# Altium schematic sheet [02] Power.SchDoc
size A3
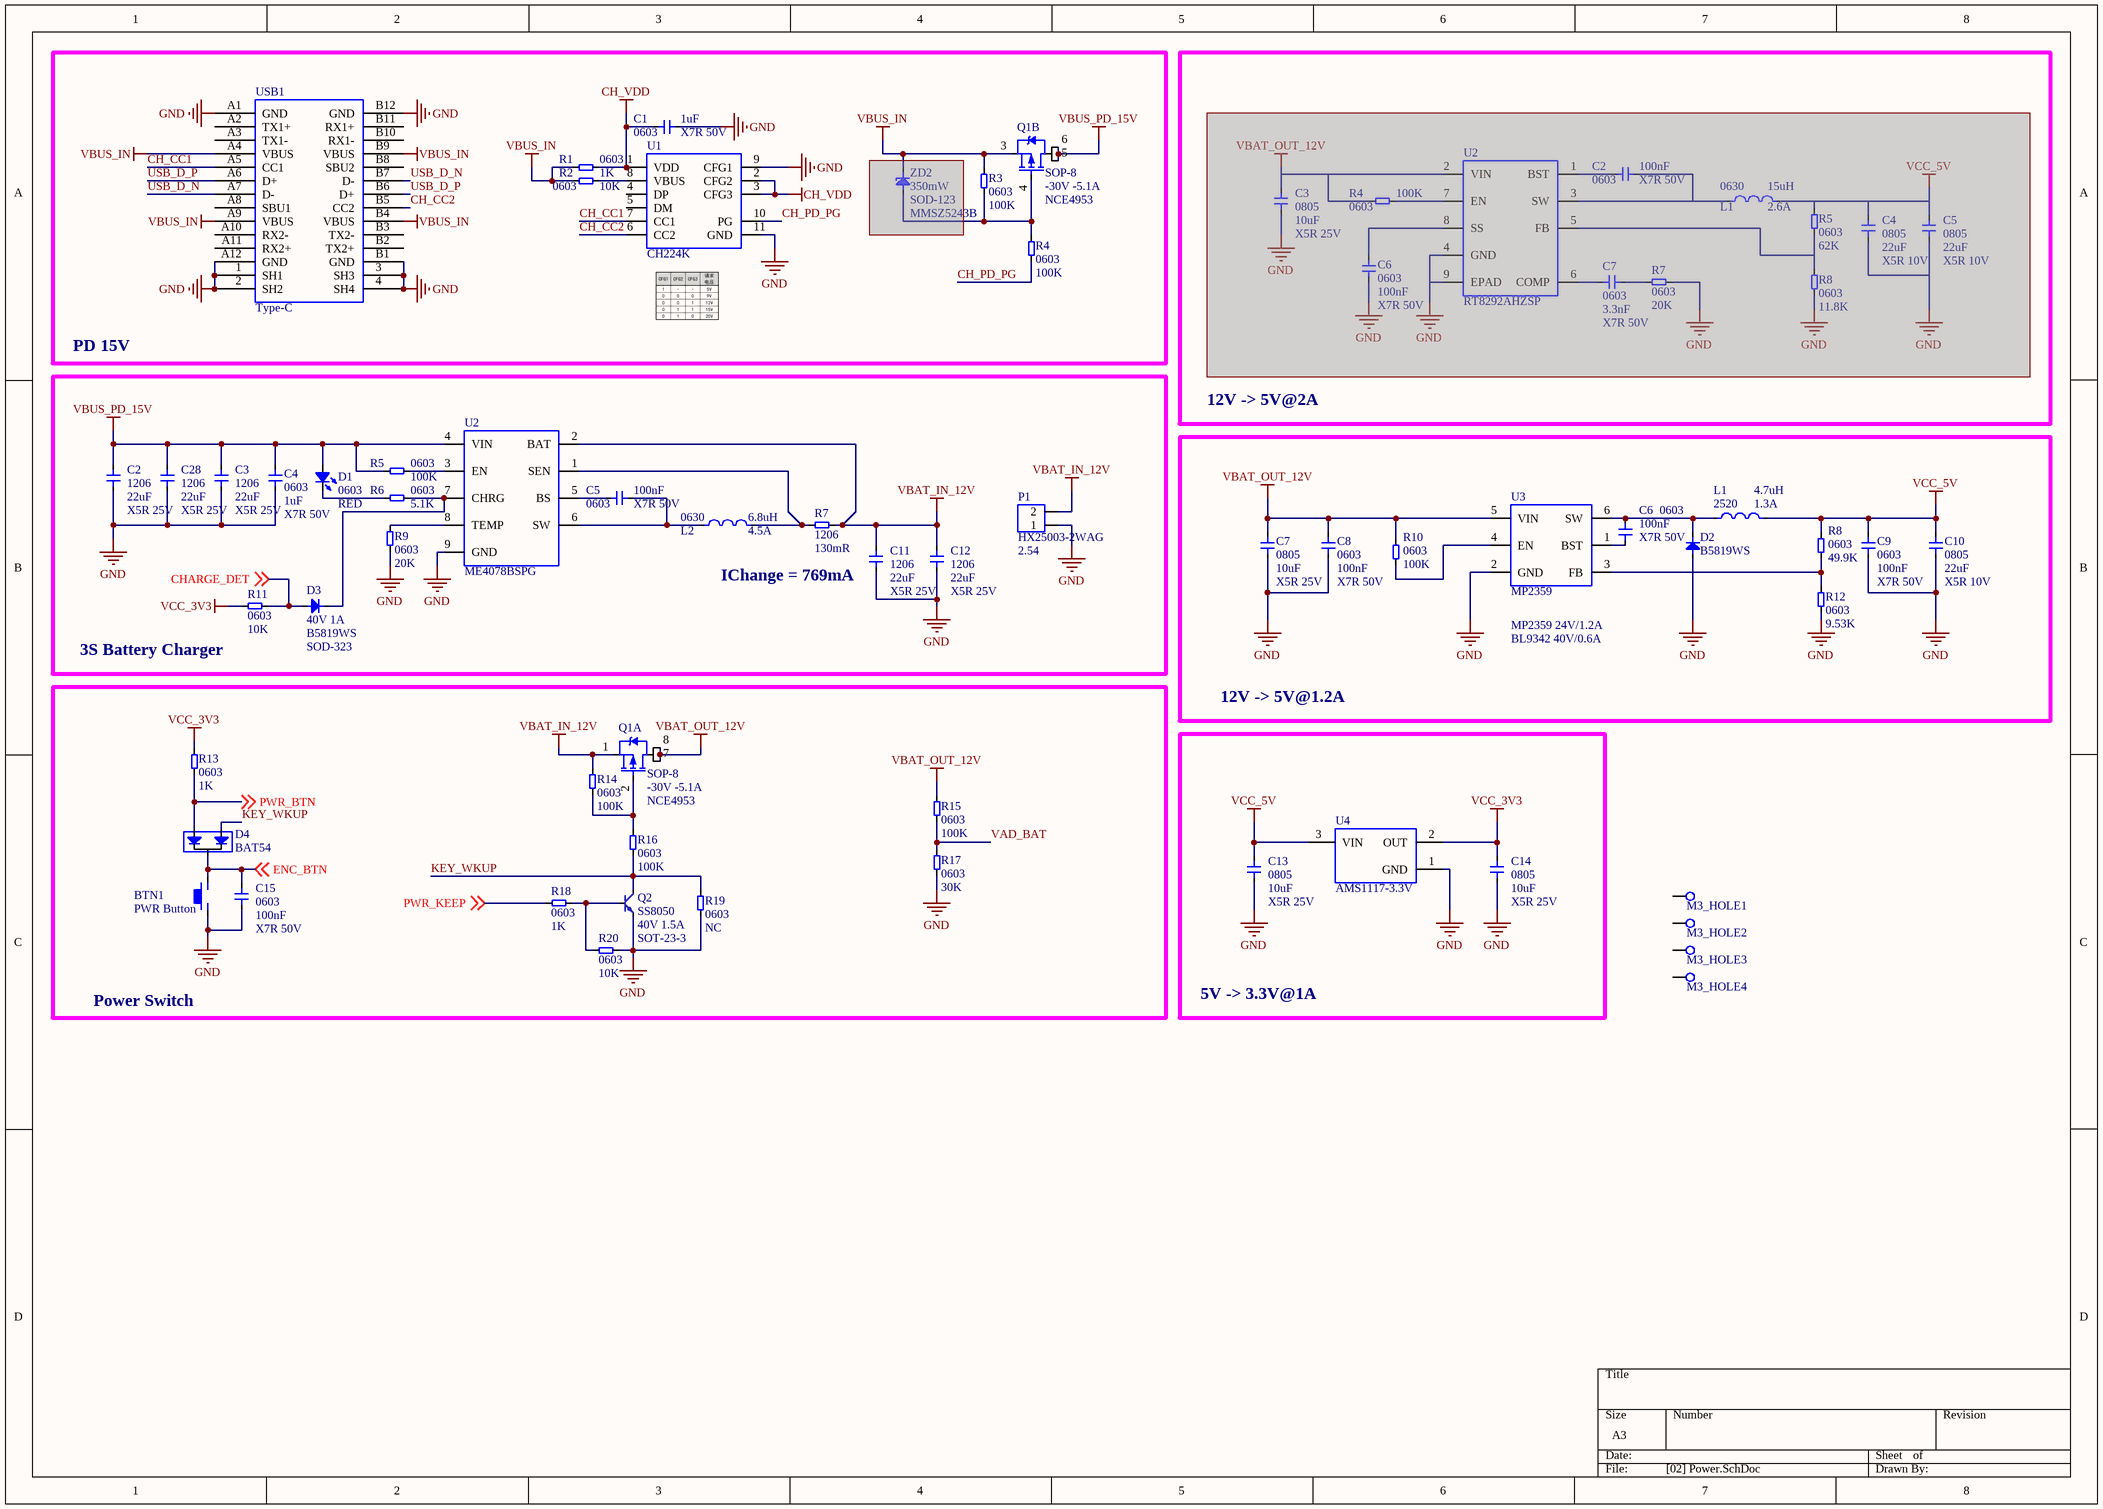
[diagram p0: [02] Power.SchDoc]

## Parts
(Parts that share a designator on the sheet are numbered #1, #2 ... from top to bottom, then left to right.)
BTN1  PWR Button  [BTN-4P-4.2*3.4*2.5]
C1  Footprint: 0603  Specification: X7R 50V  [CAP_0603]  (hidden comment: 1uF)
C2#1  Footprint: 0603  Specification: X7R 50V  [CAP_0603]  (hidden comment: 100nF)  (masked out: inside a compile mask, not in the netlist)
C2#2  Footprint: 1206  Specification: X5R 25V  [CAP_1206]  (hidden comment: 22uF)
C3#1  Footprint: 0805  Specification: X5R 25V  [CAP_0805]  (hidden comment: 10uF)  (masked out: inside a compile mask, not in the netlist)
C3#2  Footprint: 1206  Specification: X5R 25V  [CAP_1206]  (hidden comment: 22uF)
C4#1  Footprint: 0805  Specification: X5R 10V  [CAP_0805]  (hidden comment: 22uF)  (masked out: inside a compile mask, not in the netlist)
C4#2  Footprint: 0603  Specification: X7R 50V  [CAP_0603]  (hidden comment: 1uF)
C5#1  Footprint: 0805  Specification: X5R 10V  [CAP_0805]  (hidden comment: 22uF)  (masked out: inside a compile mask, not in the netlist)
C5#2  Footprint: 0603  Specification: X7R 50V  [CAP_0603]  (hidden comment: 100nF)
C6#1  Footprint: 0603  Specification: X7R 50V  [CAP_0603]  (hidden comment: 100nF)  (masked out: inside a compile mask, not in the netlist)
C6#2  Footprint: 0603  Specification: X7R 50V  [CAP_0603]  (hidden comment: 100nF)
C7#1  Footprint: 0603  Specification: X7R 50V  [CAP_0603]  (hidden comment: 3.3nF)  (masked out: inside a compile mask, not in the netlist)
C7#2  Footprint: 0805  Specification: X5R 25V  [CAP_0805]  (hidden comment: 10uF)
C8  Footprint: 0603  Specification: X7R 50V  [CAP_0603]  (hidden comment: 100nF)
C9  Footprint: 0603  Specification: X7R 50V  [CAP_0603]  (hidden comment: 100nF)
C10  Footprint: 0805  Specification: X5R 10V  [CAP_0805]  (hidden comment: 22uF)
C11  Footprint: 1206  Specification: X5R 25V  [CAP_1206]  (hidden comment: 22uF)
C12  Footprint: 1206  Specification: X5R 25V  [CAP_1206]  (hidden comment: 22uF)
C13  Footprint: 0805  Specification: X5R 25V  [CAP_0805]  (hidden comment: 10uF)
C14  Footprint: 0805  Specification: X5R 25V  [CAP_0805]  (hidden comment: 10uF)
C15  Footprint: 0603  Specification: X7R 50V  [CAP_0603]  (hidden comment: 100nF)
C28  Footprint: 1206  Specification: X5R 25V  [CAP_1206]  (hidden comment: 22uF)
D1  Footprint: 0603  [LED_0603]  (hidden comment: RED)
D2  B5819WS  [SOD-323]
D3  Specification: 40V 1A  [SOD-323]  (hidden comment: B5819WS)
D4  BAT54  [SOT-23-3]
L1#1  Specification: 2.6A  Footprint: 0630  [IND_P_0630]  (hidden comment: 15uH)  (masked out: inside a compile mask, not in the netlist)
L1#2  Specification: 1.3A  Footprint: 2520  [IND_1008]  (hidden comment: 4.7uH)
L2  Specification: 4.5A  Footprint: 0630  [IND_P_0630]  (hidden comment: 6.8uH)
M3_HOLE1  TestPoint  [Hole_M3_PAD]  (value not drawn)
M3_HOLE2  TestPoint  [Hole_M3_PAD]  (value not drawn)
M3_HOLE3  TestPoint  [Hole_M3_PAD]  (value not drawn)
M3_HOLE4  TestPoint  [Hole_M3_PAD]  (value not drawn)
P1  Type: 2.54  [XH_2-SLEEP]  (hidden comment: HX25003-2WAG)
Q1  Footprint: SOP-8  Specification: -30V -5.1A  [SOP-8-P1.27]  (hidden comment: NCE4953)  (parts A,B of 2)
Q2  Specification: 40V 1.5A  [SOT-23-3]  (hidden comment: SS8050)
R1  Footprint: 0603  [RES_0603]  (hidden comment: 1K)
R2  Footprint: 0603  [RES_0603]  (hidden comment: 10K)
R3  Footprint: 0603  [RES_0603]  (hidden comment: 100K)
R4#1  Footprint: 0603  [RES_0603]  (hidden comment: 100K)  (masked out: inside a compile mask, not in the netlist)
R4#2  Footprint: 0603  [RES_0603]  (hidden comment: 100K)
R5#1  Footprint: 0603  [RES_0603]  (hidden comment: 62K)  (masked out: inside a compile mask, not in the netlist)
R5#2  Footprint: 0603  [RES_0603]  (hidden comment: 100K)
R6  Footprint: 0603  [RES_0603]  (hidden comment: 5.1K)
R7#1  Footprint: 0603  [RES_0603]  (hidden comment: 20K)  (masked out: inside a compile mask, not in the netlist)
R7#2  Footprint: 1206  [RES_1206]  (hidden comment: 130mR)
R8#1  Footprint: 0603  [RES_0603]  (hidden comment: 11.8K)  (masked out: inside a compile mask, not in the netlist)
R8#2  Footprint: 0603  [RES_0603]  (hidden comment: 49.9K)
R9  Footprint: 0603  [RES_0603]  (hidden comment: 20K)
R10  Footprint: 0603  [RES_0603]  (hidden comment: 100K)
R11  Footprint: 0603  [RES_0603]  (hidden comment: 10K)
R12  Footprint: 0603  [RES_0603]  (hidden comment: 9.53K)
R13  Footprint: 0603  [RES_0603]  (hidden comment: 1K)
R14  Footprint: 0603  [RES_0603]  (hidden comment: 100K)
R15  Footprint: 0603  [RES_0603]  (hidden comment: 100K)
R16  Footprint: 0603  [RES_0603]  (hidden comment: 100K)
R17  Footprint: 0603  [RES_0603]  (hidden comment: 30K)
R18  Footprint: 0603  [RES_0603]  (hidden comment: 1K)
R19  Footprint: 0603  [RES_0603]  (hidden comment: NC)
R20  Footprint: 0603  [RES_0603]  (hidden comment: 10K)
U1  CH224K  [HSOP-10-P1.0]
U2#1  RT8292AHZSP  [HSOP-8-P1.27]  (masked out: inside a compile mask, not in the netlist)
U2#2  ME4078BSPG  [HSOP-8-P1.27]
U3  MP2359  [SOT-23-6]
U4  AMS1117-3.3V  [SOT-223-3]
USB1  Type-C  [USB-Type-C]
ZD2  Specification: 350mW  [SOD-123]  (hidden comment: MMSZ5243B)  (masked out: inside a compile mask, not in the netlist)

## Blocks framed on the sheet
PD 15V: C1 Q1 R1-R3 R4#2 U1 USB1 ZD2
12V -> 5V@2A: C2#1 C3#1 C4#1 C5#1 C6#1 C7#1 L1#1 R4#1 R5#1 R7#1 R8#1 U2#1
12V -> 5V@1.2A: C6#2 C7#2 C8-C10 D2 L1#2 R8#2 R10 R12 U3
Power Switch: BTN1 C15 D4 Q1 Q2 R13-R20
5V -> 3.3V@1A: C13 C14 U4

## Nets
CH_VDD: C1.1 R1.1 U1.1(VDD) U1.2(CFG2) U1.3(CFG3)
GND: BTN1.1 C1.2 C2#2.1 C3#2.1 C4#2.2 C7#2.2 C8.2 C9.2 C10.2 C11.1 C12.1 C13.1 C14.1 C15.2 C28.1 D2.1 P1.1 Q2.2(E) R9.2 R12.2 R17.1 R19.2 R20.1 U1.9(CFG1) U1.11(GND) U2#2.9(GND) U3.2(GND) U4.1(GND) USB1.1(SH1) USB1.2(SH2) USB1.3(SH3) USB1.4(SH4) USB1.A1(GND) USB1.A12(GND) USB1.B1(GND) USB1.B12(GND)
VBAT_IN_12V: C11.2 C12.2 P1.2 Q1.1(S) R7#2.1 R14.2 U2#2.2(BAT)
VBAT_OUT_12V: C7#2.1 C8.1 Q1.7(D) Q1.8(D) R10.1 R15.2 U3.5(VIN)
VBUS_IN: Q1.3(S) R1.2 R2.2 R3.2 USB1.A4(VBUS) USB1.A9(VBUS) USB1.B4(VBUS) USB1.B9(VBUS)
VBUS_PD_15V: C2#2.2 C3#2.2 C4#2.1 C28.2 D1.1(A) Q1.5(D) Q1.6(D) R5#2.2 U2#2.4(VIN)
VCC_3V3: C14.2 R11.1 R13.2 U4.2(OUT)
VCC_5V: C9.1 C10.1 C13.2 L1#2.2 R8#2.1 U4.3(VIN)
CH_CC1: U1.7(CC1) USB1.A5(CC1)
CH_CC2: U1.6(CC2) USB1.B5(CC2)
CH_PD_PG: R4#2.1 U1.10(PG)
CHARGE_DET: D3.1 R11.2 ; off-sheet CHARGE_DET
ENC_BTN: BTN1.2 C15.1 D4.3 ; off-sheet ENC_BTN
KEY_WKUP: D4.2 Q2.3(C) R16.1 R19.1
PWR_BTN: D4.1 R13.1 ; off-sheet PWR_BTN
PWR_KEEP: R18.1 ; off-sheet PWR_KEEP
USB_D_N: USB1.A7(D-) USB1.B7(D-)
USB_D_P: USB1.A6(D+) USB1.B6(D+)
VAD_BAT: R15.1 R17.2
NetC5#2_1: C5#2.1 L2.1 U2#2.6(SW)
NetC5#2_2: C5#2.2 U2#2.5(BS)
NetC6#2_1: C6#2.1 D2.2 L1#2.1 U3.6(SW)
NetC6#2_2: C6#2.2 U3.1(BST)
NetD1_2: D1.2(K) R6.2
NetD3_2: D3.2 R6.1 U2#2.7(CHRG)
NetL2_2: L2.2 R7#2.2 U2#2.1(SEN)
NetQ1_2: Q1.2(G) R14.1 R16.2
NetQ1_4: Q1.4(G) R3.1 R4#2.2
NetQ2_1: Q2.1(B) R18.2 R20.2
NetR2_1: R2.1 U1.8(VBUS)
NetR5#2_1: R5#2.1 U2#2.3(EN)
NetR8#2_2: R8#2.2 R12.1 U3.3(FB)
NetR9_1: R9.1 U2#2.8(TEMP)
NetR10_2: R10.2 U3.4(EN)

Not connected (* = marked no-connect by the designer): M3_HOLE1 1; M3_HOLE2 1; M3_HOLE3 1; M3_HOLE4 1; U1 4(DP) 5(DM); USB1 A2(TX1+) A3(TX1-) A8(SBU1) A10(RX2-) A11(RX2+) B2(TX2+) B3(TX2-) B8(SBU2) B10(RX1-) B11(RX1+)

## Notes on the sheet
- IChange = 769mA
- (near U3) MP2359 24V/1.2A
- BL9342 40V/0.6A
- (near R11) 3S Battery Charger
- Title
- Size:
- Date:
- A4
- Number:
- Time:
- Revision:
- Sheet
- of
- File:

## Library data of the parts
BTN1 = Button
C1 C2#1 C2#2 C3#1 C3#2 C4#1 C4#2 C5#1 C5#2 C6#1 C6#2 C7#1 C7#2 C8-C15 C28 = CAP: Capacitor; Manufacturer: *
  C1 C4#2: Value: 1uF
  C2#1 C5#2 C6#1 C6#2 C8 C9 C15: Value: 100nF
  C2#2 C3#2 C4#1 C5#1 C10-C12 C28: Value: 22uF
  C3#1 C7#2 C13 C14: Value: 10uF
  C7#1: Value: 3.3nF
D1 = LED: Value: RED
D2 = Diode: Specification: 40V 1A; Manufacturer: *; Value: B5819WS
D3 = Diode: Manufacturer: *; Value: B5819WS
D4 = Diode-2: Value: BAT54
L1#1 L1#2 L2 = IND: Inductor; Manufacturer: *
  L1#1: Value: 15uH
  L1#2: Value: 4.7uH
  L2: Value: 6.8uH
P1 = HDR1x2: Header; Value: HX25003-2WAG
Q1 = Dual_MOS-P: Dual P-Channel MOSFET; Value: NCE4953
Q2 = BJT_NPN: Transistor; Value: SS8050
R1-R3 R4#1 R4#2 R5#1 R5#2 R6 R7#1 R7#2 R8#1 R8#2 R9-R20 = RES: Resistor; Specification: ±1%; Manufacturer: *
  R1 R13 R18: Value: 1K
  R2 R11 R20: Value: 10K
  R3 R4#1 R4#2 R5#2 R10 R14-R16: Value: 100K
  R5#1: Value: 62K
  R6: Value: 5.1K
  R7#1 R9: Value: 20K
  R7#2: Value: 130mR
  R8#1: Value: 11.8K
  R8#2: Value: 49.9K
  R12: Value: 9.53K
  R17: Value: 30K
  R19: Value: NC
U1 = CH224K: USB PD 等多快充协议受电芯片
U2#1 = RT8292A: 2A, 23V, 340kHz Synchronous Step-Down Converter
U2#2 = ME4078: 双节、三节开关型锂电池管理
U3 = MP2456
U4 = LM1117-3.3V
USB1 = USB-Type-C
ZD2 = Diode-ZD: Zender Diode; Manufacturer: *; Value: MMSZ5243B